# Altium schematic sheet CAN_Switch.SCHDOC
size A4; Organization: UNSW Solar Racing Team; Address3: UNSW; Address4: Sydney NSW 2052; Address2: Electrical Engineering; Address1: Rm 109
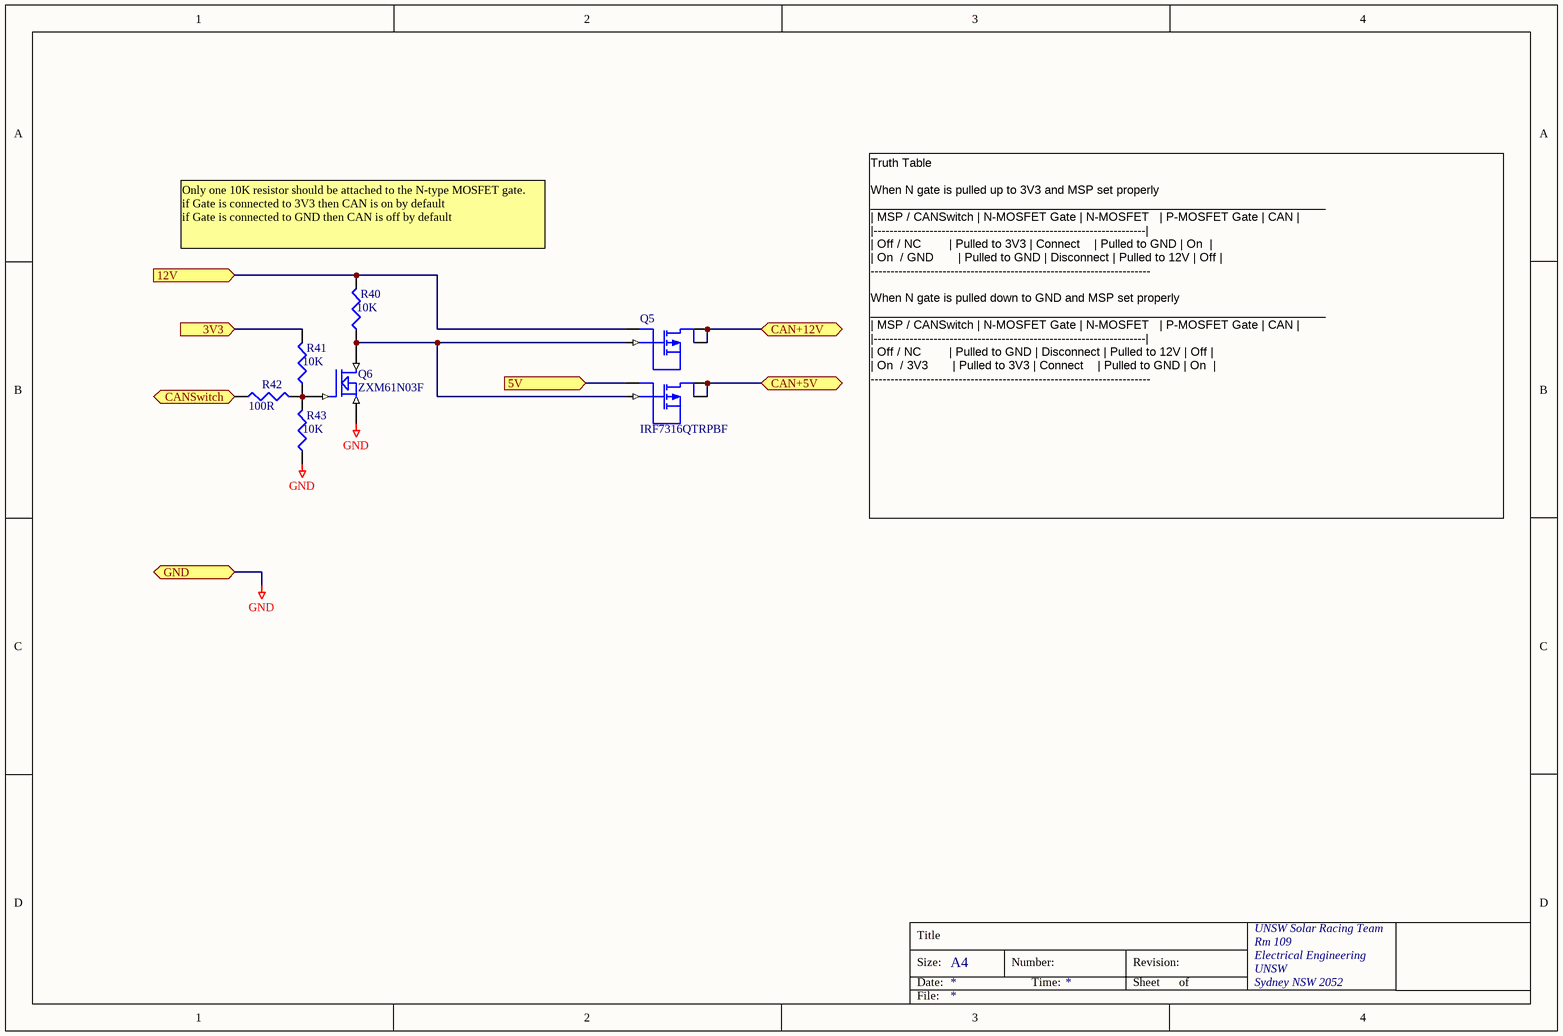
[diagram p0: CAN_Switch.SCHDOC]

## Parts
Q5  IRF7316QTRPBF  [SO8]
Q6  ZXM61N03F  [SOT23-3]
R40  10K  [0603]
R41  10K  [0603]
R42  100R  [0603]
R43  10K  [0603]

## Ports
3V3, 5V (in), 12V (in), CAN+5V (bidir), CAN+12V (bidir), CANSwitch (in), GND (bidir)

## Nets
GND: Q6.2(S) R43.1 ; port GND
3V3: R41.2 ; port 3V3
5V: Q5.3(S2) ; port 5V
12V: Q5.1(S1) R40.2 ; port 12V
CAN+5V: Q5.5(D2) Q5.6(D2) ; port CAN+5V
CAN+12V: Q5.7(D1) Q5.8(D1) ; port CAN+12V
CANSwitch: R42.1 ; port CANSwitch
NetQ5_2: Q5.2(G1) Q5.4(G2) Q6.3(D) R40.1
NetQ6_1: Q6.1(G) R41.1 R42.2 R43.2

## Notes on the sheet
- (near R40) Only one 10K resistor should be attached to the N-type MOSFET gate.
  if Gate is connected to 3V3 then CAN is on by default
  if Gate is connected to GND then CAN is off by default
- Truth Table
  When N gate is pulled up to 3V3 and MSP set properly
  ______________________________________________________________________
  | MSP / CANSwitch | N-MOSFET Gate | N-MOSFET   | P-MOSFET Gate | CAN |
  |--------------------------------------------------------------------|
  | Off / NC        | Pulled to 3V3 | Connect    | Pulled to GND | On  |
  | On  / GND       | Pulled to GND | Disconnect | Pulled to 12V | Off |
  ----------------------------------------------------------------------
  When N gate is pulled down to GND and MSP set properly
  ______________________________________________________________________
  | MSP / CANSwitch | N-MOSFET Gate | N-MOSFET   | P-MOSFET Gate | CAN |
  |--------------------------------------------------------------------|
  | Off / NC        | Pulled to GND | Disconnect | Pulled to 12V | Off |
  | On  / 3V3       | Pulled to 3V3 | Connect    | Pulled to GND | On  |
  ----------------------------------------------------------------------
- Title
- Size:
- Date:
- A4
- Number:
- Time:
- Revision:
- Sheet
- of
- File:

## Library data of the parts
Q5 = IRF7316QTRPBF: Dual P-type MOSFET IC; Farnell: 1531284; FarnellPrice: 1.47; Digikey: IRF7316QTRPBFCT-ND; DigikeyPrice: 1.8
Q6 = ZXM61N02F: 1.7A, 20V N-Channel Enhancement mode FET; Farnell: 9525289; Price: 0.73; Digikey: ZXM61N03FCT-ND; DigikeyPrice: 0.72
R40 R41 R43 = RES1: Resistor; Farnell: 9330399; Price: 0.06
R42 = RES1: Farnell: 9330364; Price: 0.06